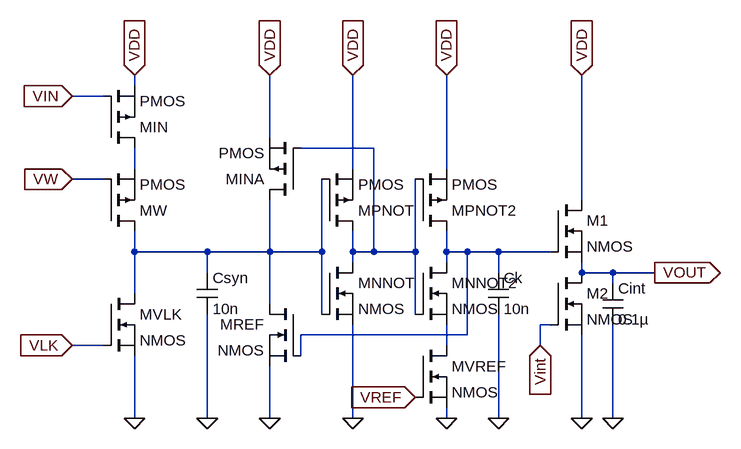
[diagram p0: schematic OZ.asc]
OZ.asc, the LTspice schematic file:
Version 4
SHEET 1 10228 1780
WIRE 5776 -5392 5776 -5408
WIRE 5728 -5376 5680 -5376
WIRE 5984 -5312 5984 -5408
WIRE 6144 -5296 6032 -5296
WIRE 5776 -5264 5776 -5296
WIRE 6112 -5264 6112 -5408
WIRE 6256 -5264 6256 -5408
WIRE 5728 -5248 5680 -5248
WIRE 6464 -5216 6464 -5408
WIRE 5776 -5136 5776 -5168
WIRE 5888 -5136 5776 -5136
WIRE 5984 -5136 5984 -5216
WIRE 5984 -5136 5888 -5136
WIRE 6064 -5136 6064 -5248
WIRE 6064 -5136 5984 -5136
WIRE 6112 -5136 6112 -5168
WIRE 6144 -5136 6144 -5296
WIRE 6144 -5136 6112 -5136
WIRE 6208 -5136 6208 -5248
WIRE 6208 -5136 6144 -5136
WIRE 6256 -5136 6256 -5168
WIRE 6288 -5136 6256 -5136
WIRE 6336 -5136 6288 -5136
WIRE 6416 -5136 6336 -5136
WIRE 6112 -5120 6112 -5136
WIRE 6256 -5120 6256 -5136
WIRE 5888 -5104 5888 -5136
WIRE 6336 -5104 6336 -5136
WIRE 6464 -5104 6464 -5120
WIRE 6512 -5104 6464 -5104
WIRE 6576 -5104 6512 -5104
WIRE 6464 -5088 6464 -5104
WIRE 6512 -5088 6512 -5104
WIRE 5776 -5072 5776 -5136
WIRE 5984 -5056 5984 -5136
WIRE 6064 -5040 6064 -5136
WIRE 6208 -5040 6208 -5136
WIRE 6416 -5024 6400 -5024
WIRE 6288 -5008 6288 -5136
WIRE 6288 -5008 6032 -5008
WIRE 5728 -4992 5680 -4992
WIRE 6256 -4992 6256 -5024
WIRE 6400 -4992 6400 -5024
WIRE 6032 -4976 6032 -5008
WIRE 5776 -4880 5776 -4976
WIRE 5888 -4880 5888 -5040
WIRE 5984 -4880 5984 -4960
WIRE 6112 -4880 6112 -5024
WIRE 6256 -4880 6256 -4896
WIRE 6336 -4880 6336 -5040
WIRE 6464 -4880 6464 -5008
WIRE 6512 -4880 6512 -5024
FLAG 6112 -5408 VDD
IOPIN 6112 -5408 In
FLAG 5680 -5376 VIN
IOPIN 5680 -5376 In
FLAG 5680 -5248 VW
IOPIN 5680 -5248 In
FLAG 5680 -4992 VLK
IOPIN 5680 -4992 In
FLAG 6208 -4912 VREF
IOPIN 6208 -4912 In
FLAG 6400 -4992 Vint
IOPIN 6400 -4992 In
FLAG 6576 -5104 VOUT
IOPIN 6576 -5104 Out
FLAG 5776 -4880 0
FLAG 5888 -4880 0
FLAG 5984 -4880 0
FLAG 6112 -4880 0
FLAG 6256 -4880 0
FLAG 6336 -4880 0
FLAG 6464 -4880 0
FLAG 6512 -4880 0
FLAG 5984 -5408 VDD
IOPIN 5984 -5408 In
FLAG 5776 -5408 VDD
IOPIN 5776 -5408 In
FLAG 6464 -5408 VDD
IOPIN 6464 -5408 In
FLAG 6256 -5408 VDD
IOPIN 6256 -5408 In
SYMBOL pmos 5728 -5168 M180
WINDOW 0 56 32 Left 0
WINDOW 3 56 72 Left 0
SYMATTR InstName MW
SYMBOL cap 5872 -5104 R0
WINDOW 0 24 8 Left 0
WINDOW 3 24 56 Left 0
SYMATTR InstName Csyn
SYMATTR Value 10n
SYMATTR SpiceLine V=4 Irms=162m Rser=0.395426 Lser=0 mfg="KEMET" pn="C0402C103K7PAC" type="X5R" IC=0
SYMBOL cap 6320 -5104 R0
WINDOW 0 24 8 Left 0
WINDOW 3 24 56 Left 0
SYMATTR InstName Ck
SYMATTR Value 10n
SYMBOL pmos 6064 -5168 M180
WINDOW 0 56 32 Left 0
WINDOW 3 56 72 Left 0
SYMATTR InstName MPNOT
SYMBOL nmos 6064 -5120 R0
WINDOW 0 56 32 Left 0
WINDOW 3 56 72 Left 0
SYMATTR InstName MNNOT
SYMBOL nmos 6208 -4992 R0
WINDOW 0 56 32 Left 0
WINDOW 3 56 72 Left 0
SYMATTR InstName MVREF
SYMBOL nmos 6032 -5056 M0
WINDOW 0 56 32 Left 0
WINDOW 3 56 72 Left 0
SYMATTR InstName MREF
SYMBOL nmos 5728 -5072 R0
WINDOW 0 56 32 Left 0
WINDOW 3 56 72 Left 0
SYMATTR InstName MVLK
SYMBOL pmos 6032 -5216 R180
WINDOW 0 56 32 Left 0
WINDOW 3 56 72 Left 0
SYMATTR InstName MINA
SYMBOL pmos 5728 -5296 M180
WINDOW 0 56 32 Left 0
WINDOW 3 56 72 Left 0
SYMATTR InstName MIN
SYMBOL pmos 6208 -5168 M180
WINDOW 0 56 32 Left 0
WINDOW 3 56 72 Left 0
SYMATTR InstName MPNOT2
SYMBOL nmos 6208 -5120 R0
WINDOW 0 56 32 Left 0
WINDOW 3 56 72 Left 0
SYMATTR InstName MNNOT2
SYMBOL nmos 6416 -5216 R0
WINDOW 0 56 32 Left 0
WINDOW 3 56 72 Left 0
SYMATTR InstName M1
SYMBOL nmos 6416 -5104 R0
WINDOW 0 56 32 Left 0
WINDOW 3 56 72 Left 0
SYMATTR InstName M2
SYMBOL cap 6496 -5088 R0
WINDOW 0 24 8 Left 0
WINDOW 3 24 56 Left 0
SYMATTR InstName Cint
SYMATTR Value 0.1µ

The netlist it stands for:
* OZ.asc
MW N003 VW N002 N002 PMOS
Csyn N003 0 10n V=4 Irms=162m Rser=0.395426 Lser=0 mfg="KEMET" pn="C0402C103K7PAC" type="X5R" IC=0
Ck N004 0 10n
MPNOT N001 N003 VDD VDD PMOS
MNNOT N001 N003 0 0 NMOS
MVREF N005 VREF 0 0 NMOS
MREF N003 N004 0 0 NMOS
MVLK N003 VLK 0 0 NMOS
MINA N003 N001 VDD VDD PMOS
MIN N002 VIN VDD VDD PMOS
MPNOT2 N004 N001 VDD VDD PMOS
MNNOT2 N004 N001 N005 N005 NMOS
M1 VDD N004 VOUT VOUT NMOS
M2 VOUT Vint 0 0 NMOS
Cint VOUT 0 0.1µ
.model NMOS NMOS
.model PMOS PMOS
.lib standard.mos
.backanno
.end